# Altium schematic sheet PLD_RadFET_ADC.SchDoc: A 24-bit AD7714YRZ Analog-to-Digital Converter
size A4; Revision: 1; SheetTotal: 32; PageSetup: Record=PageOptions|CenterHorizontal=True|CenterVertical=True|PrintScale=1.00|XCorrection=1.00|YCorrection=1.00|PrintKind=0|BorderSize=5000000|LeftOffset=0|BottomOffset=0|Orientation=2|PaperLength=1000|PaperWidth=1000|Scale=100|PaperSource=7|PrintQuality=-3|MediaType=1|DitherType=10|PrintScaleMode=1|PaperKind=A4|PaperIndex=9; Model: DM1
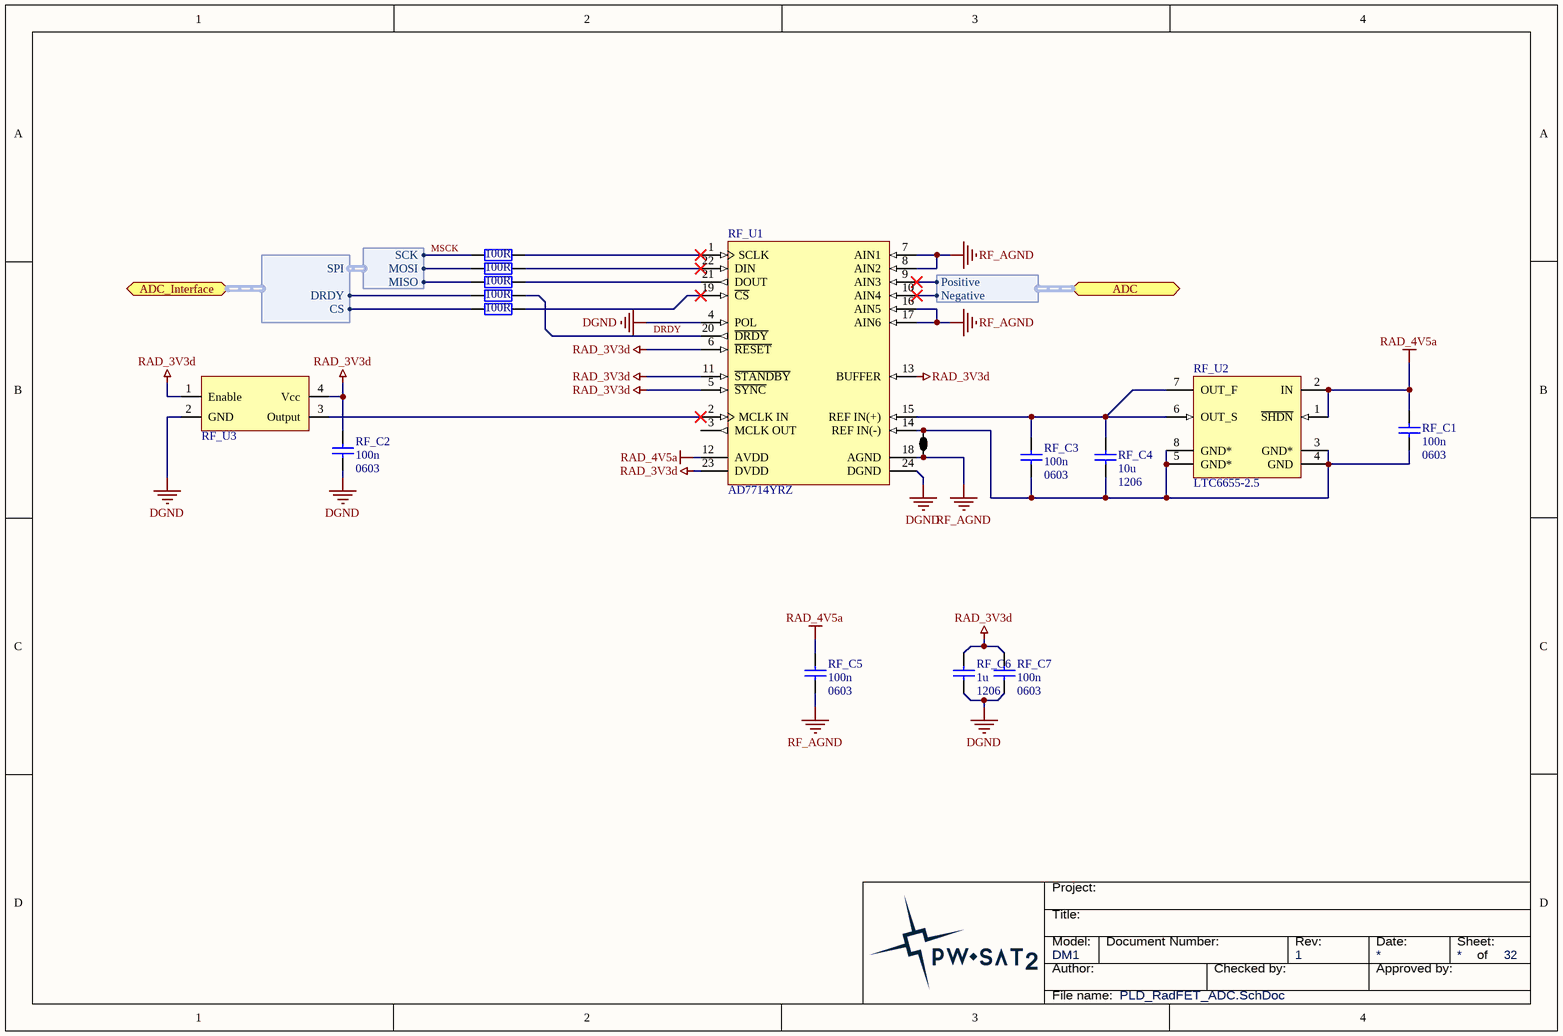
[diagram p0: PLD_RadFET_ADC.SchDoc]

## Parts
ADC_J2  2 way net tie junction  [2way_LP]  (value not drawn)  (net tie, no BOM)
RF_C1  value 100n  Package: 0603  [SMD_Capacitor_0603]  (hidden comment: Cap)
RF_C2  value 100n  Package: 0603  [SMD_Capacitor_0603]  (hidden comment: Cap)
RF_C3  value 100n  Package: 0603  [SMD_Capacitor_0603]  (hidden comment: Cap)
RF_C4  value 10u  Package: 1206  [SMD_Capacitor_1206]  (hidden comment: Cap)
RF_C5  value 100n  Package: 0603  [SMD_Capacitor_0603]  (hidden comment: Cap)
RF_C6  value 1u  Package: 1206  [SMD_Capacitor_1206]  (hidden comment: Cap)
RF_C7  value 100n  Package: 0603  [SMD_Capacitor_0603]  (hidden comment: Cap)
RF_R1  100R  [SMD_Resistor_0603]
RF_R2  100R  [SMD_Resistor_0603]
RF_R25  100R  [SMD_Resistor_0603]
RF_R26  100R  [SMD_Resistor_0603]
RF_R27  100R  [SMD_Resistor_0603]
RF_U1  AD7714YRZ  [TSSOP-24-RU-24-N]
RF_U2  LTC6655-2.5  [MSOP-8]
RF_U3  Ceramic Crystal  [2.0 x 2.5 mm]  (value not drawn)

## Ports
ADC (harness ADC Channel), ADC_Interface (harness ADC_DIGITAL)

## Harnesses
ADC_DIGITAL: DRDY, CS, SPI
SPI: SCK, MOSI, MISO
ADC Channel: Positive, Negative

## Nets
DGND: RF_C2.2 RF_C6.2 RF_C7.2 RF_U1.4(POL) RF_U1.24(DGND) RF_U3.2(GND)
RAD_3V3d: RF_C2.1 RF_C6.1 RF_C7.1 RF_U1.5(~{SYNC}) RF_U1.6(~{RESET}) RF_U1.11(~{STANDBY}) RF_U1.13(BUFFER) RF_U1.23(DVDD) RF_U3.1(Enable) RF_U3.4(Vcc)
RAD_4V5a: RF_C1.1 RF_C5.1 RF_U1.12(AVDD) RF_U2.1(~{SHDN}) RF_U2.2(IN)
RF_AGND: ADC_J2.1 RF_C5.2 RF_U1.7(AIN1) RF_U1.8(AIN2) RF_U1.16(AIN5) RF_U1.17(AIN6) RF_U1.18(AGND)
DRDY: RF_R26.2 RF_U1.20(~{DRDY})
MSCK: RF_R1.1 ; harness SPI.SCK
NetADC_J2_2: ADC_J2.2 RF_C1.2 RF_C3.2 RF_C4.2 RF_U1.14(REF_IN(-)) RF_U2.3(GND*) RF_U2.4(GND) RF_U2.5(GND*) RF_U2.8(GND*)
NetRF_C3_1: RF_C3.1 RF_C4.1 RF_U1.15(REF_IN(+)) RF_U2.6(OUT_S) RF_U2.7(OUT_F)
NetRF_R1_2: RF_R1.2 RF_U1.1(SCLK)
NetRF_R2_1: RF_R2.1 ; harness SPI.MOSI
NetRF_R2_2: RF_R2.2 RF_U1.22(DIN)
NetRF_R25_1: RF_R25.1 ; harness SPI.MISO
NetRF_R25_2: RF_R25.2 RF_U1.21(DOUT)
NetRF_R26_1: RF_R26.1 ; port ADC_Interface.DRDY
NetRF_R27_1: RF_R27.1 ; port ADC_Interface.CS
NetRF_R27_2: RF_R27.2 RF_U1.19(~{CS})
NetRF_U1_2: RF_U1.2(MCLK_IN) RF_U3.3(Output)
NetRF_U1_9: RF_U1.9(AIN3) ; port ADC.Positive
NetRF_U1_10: RF_U1.10(AIN4) ; port ADC.Negative

Not connected (* = marked no-connect by the designer): RF_U1 3(MCLK_OUT)

## Notes on the sheet
- Title:
- Project:
- Author:
- Model:
- Document Number:
- Checked by:
- Rev:
- Date:
- Approved by:
- Sheet:
- of
- File name:

## Library data of the parts
ADC_J2 = 2way: ComponentLink1URL: http://www.edatools.cz/addons; ComponentLink1Description: Source; FootprintNote: LP=12mil, MP=40mil, HP=120mil
RF_R1 RF_R2 RF_R25-RF_R27 = Res: Value: 100R; Package: 0603
RF_U1 = AD7714YRZ: 5 Channel 24-Bit Signal Conditioning Analog-to-Digital Converter with Serial, SPI Interface, 500 uA, CMOS, 3 V / 5 V, 1KSPS, -40 to +105 degC, RW-24, Pb-Free, Tube; Generic Part Number: AD7714; Manufacturer: Analog Devices; Resolution (Bits): 24; Channels: 5; Throughput Rate (SPS): 1K; Interface: Ser, SPI; DatasheetVersion: Rev.C; PackageVersion: 060706-A; PackageReference: RW-24; PackageDescription: 24-Lead Standard Small Outline Package [SOIC_W]; Supplier 1: Digi-Key; Supplier Part Number 1: AD7714YRZ-ND; Supplier 2: Farnell; Supplier Part Number 2: 1438858; Supplier 3: Newark; Supplier Part Number 3: 15P0854; Supplier 4: Newark; Supplier Part Number 4: 59K5335; Supplier 5: Mouser; Supplier Part Number 5: 584-AD7714YRZ; RoHS: Y; Packing: Tube; Mounting Technology: Surface Mount; Code_JEDEC: MS-013-AD; PartNumber: AD7714YRZ; ComponentLink1Description: Manufacturer URL; ComponentLink1URL: http://www.analog.com/en/index.html; ComponentLink2Description: Datasheet; ComponentLink2URL: http://www.analog.com/static/imported-files/data_sheets/AD7714.pdf; ComponentLink3Description: Package Specification; ComponentLink3URL: http://www.analog.com/static/imported-files/packages/33665150946139RW_24.pdf; ComponentLink4Description: Product URL; ComponentLink4URL: http://www.analog.com/en/analog-to-digital-converters/ad-converters/ad7714/products/product.html
RF_U2 = LTC6655-2.5: 0.25ppm Noise, Low Drift  Precision References; PartNumber: LTC6655-2.5; ComponentLink1Description: Manufacturer URL; ComponentLink1URL: http://www.linear.com/; ComponentLink2Description: Datasheet; ComponentLink2URL: http://cds.linear.com/docs/en/datasheet/6655fe.pdf
RF_U3 = ISM95-3351AH-1.0000: Ceramic Crystal 1 MHz, A-Grade 25 ppm/deg